# EAGLE design esquema (EAGLE 6.6.0)
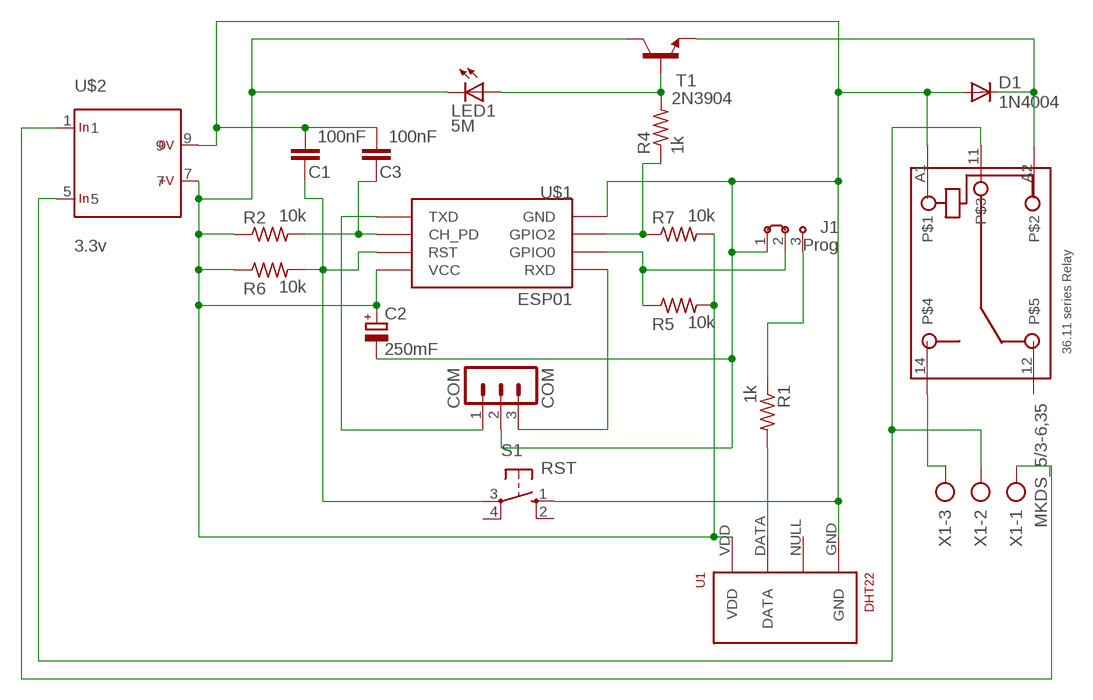
[diagram p0: schematic, sheet 1]

## Parts
C1  100nF  0.1UF-50V-20%(PTH)KIT-EZ  [CAP-PTH-SMALL-KIT]
C2  250mF  CPOL-EUE2-5  [E2-5]
C3  100nF  0.1UF-50V-20%(PTH)KIT-EZ  [CAP-PTH-SMALL-KIT]
COM  COM  MA03-1  [MA03-1]
D1  1N4004  [DO41-10]
J1  Prog  J2X2MM  [04C]
K1  36.11  [36.11]
LED1  5M  LED3MM  [LED3MM]
R1  1k  R-US_0204/5  [0204/5]
R2  10k  R-US_0204/5  [0204/5]
R4  1k  R-US_0204/5  [0204/5]
R5  10k  R-US_0204/5  [0204/5]
R6  10k  R-US_0204/5  [0204/5]
R7  10k  R-US_0204/5  [0204/5]
S1  RST  10-XX  [B3F-10XX]
T1  2N3904  [TO92]
U1  DHT22  RHT03_DHT-22_AM2302  [RHT03_DHT-22]
U$1  ESP01  [ESP01]
U$2  3.3v  SINGLE  [1]
X1  MKDS_5/3-6,35  [MKDS_5/3-635]

## Nets
GPI02: R4.1 R7.1 U$1.GPIO2
GPIO0: J1.2 R5.1 U$1.GPIO0
N$1: D1.C K1.A2 T1.3(E)
N$2: C3.1 R2.2 U$1.CH_PD
N$3: J1.3 R1.1
N$6: K1.11 U$2.5 X1.2
N$7: LED1.A R4.2 T1.2(B)
N$9: R1.2 U1.DATA
N$13: COM.1 U$1.TX(TXD)
N$14: COM.3 U$1.RX(RXD)
N$16: U$2.1 X1.1
N$17: K1.14 X1.3
RST: C1.1 R6.2 S1.3(P) U$1.RST
V0: C1.2 C2.- C3.2 COM.2 D1.A J1.1 K1.A1 S1.1(S) U1.GND U$1.GND U$2.9
V+: C2.+ LED1.K(C) R2.1 R5.2 R6.1 R7.2 T1.1(C) U1.VDD U$1.VCC U$2.7
Unconnected: K1.12 S1.2(S1) S1.4(P1) U1.NULL

## Library data of the parts
C1 C3 = SparkFun-Capacitors:0.1UF-50V-20%(PTH): CAP-08370; PROD_ID: CAP-08370
C2 = resistor:CPOL-EU: POLARIZED CAPACITOR, European symbol
COM = con-lstb:MA03-1: PIN HEADER; MF: MOLEX; MPN: 47053-1000; OC_FARNELL: 2313705; OC_NEWARK: unknown
D1 = diode:1N4004: DIODE general purpose rectifier, 1 A; MF: VISHAY; MPN: 1N4004-E3/54; OC_FARNELL: 1836082
J1 = jumper:J2: Jumper switch 2 x 2.5 mm
K1 = relay_finder_36_11:36.11: Printed circuit mount miniature 10 A relay one pole changeover contacts Conform RoHS
LED1 = led:LED: LED OSRAM: - CHIPLED LG R971, LG N971, LY N971, LG Q971, LY Q971, LO R971, LY R971 LH N974, LH R974 LS Q976, LO Q976, LY Q976 LO Q996 - Hyper CHIPLED LW Q18S LB Q993, LB Q99A, LB R99A - SideLED LS A670, LO A670, LY A670, LG A670, LP A670 LB A673, LV A673, LT A673, LW A673 LH A674 LY A675 LS A676, LA A676, LO A676, LY A676, LW A676 LS A679, LY A679, LG A679 - Hyper Micro SIDELED® LS Y876, LA Y876, LO Y876, LY Y876 LT Y87S - SmartLED LW L88C, LW L88S LB L89C, LB L89S, LG L890 LS L89K, LO L89K, LY L89K LS L896, LA L896, LO L896, LY L896 - TOPLED LS T670, LO T670, LY T670, LG T670, LP T670 LSG T670, LSP T670, LSY T670, LOP T670, LYG T670 LG T671, LOG T671, LSG T671 LB T673, LV T673, LT T673, LW T673 LH T674 LS T676, LA T676, LO T676, LY T676, LB T676, LH T676, LSB T676, LW T676 LB T67C, LV T67C, LT T67C, LS T67K, LO T67K, LY T67K, LW E67C LS E67B, LA E67B, LO E67B, LY E67B, LB E67C, LV E67C, LT E67C LW T67C LS T679, LY T679, LG T679 LS T770, LO T770, LY T770, LG T770, LP T770 LB T773, LV T773, LT T773, LW T773 LH T774 LS E675, LA E675, LY E675, LS T675 LS T776, LA T776, LO T776, LY T776, LB T776 LHGB T686 LT T68C, LB T68C - Hyper Mini TOPLED® LB M676 - Mini TOPLED Santana® LG M470 LS M47K, LO M47K, LY M47K Source: http://www.osram.convergy.de LUXEON: - LUMILED® LXK2-PW12-R00, LXK2-PW12-S00, LXK2-PW14-U00, LXK2-PW14-V00 LXK2-PM12-R00, LXK2-PM12-S00, LXK2-PM14-U00 LXK2-PE12-Q00, LXK2-PE12-R00, LXK2-PE12-S00, LXK2-PE14-T00, LXK2-PE14-U00 LXK2-PB12-K00, LXK2-PB12-L00, LXK2-PB12-M00, LXK2-PB14-N00, LXK2-PB14-P00, LXK2-PB14-Q00 LXK2-PR12-L00, LXK2-PR12-M00, LXK2-PR14-Q00, LXK2-PR14-R00 LXK2-PD12-Q00, LXK2-PD12-R00, LXK2-PD12-S00 LXK2-PH12-R00, LXK2-PH12-S00 LXK2-PL12-P00, LXK2-PL12-Q00, LXK2-PL12-R00 Source: www.luxeon.com KINGBRIGHT: KA-3528ASYC Source: www.kingbright.com; MF: VISHAY; MPN: HVR3700001504JA100; OC_FARNELL: 9477292
R1 = resistor:R-US_: RESISTOR, American symbol; MF: MULTICOMP; MPN: MCF 0.25W 1K; OC_FARNELL: 9339051
R2 R4-R7 = resistor:R-US_: RESISTOR, American symbol; MF: MULTICOMP; MPN: MCF 0.25W 10K; OC_FARNELL: 9339060
S1 = switch-omron:10-XX: OMRON SWITCH; MPN: B3F-1000; OC_FARNELL: 176432; OC_NEWARK: 36M3542
T1 = transistor:2N3904: NPN TRANSISTOR; MF: MULTICOMP; MPN: 2N3904; OC_FARNELL: 1574370
U1 = RHT03_DHT-22_AM2302:RHT03_DHT-22_AM2302: RHT03 / DHT-22 / AM2302 Packages and symbol for the RHT03 / DHT-22 relative humidity and temperature sensor. Note: The AM2302 is a wired version of the DHT-22 which typically requires less clearance and is thus provided as a separate package.; OC_FARNELL: unknown; PROD_ID: SEN-10167
U$1 = esp8266modules:ESP01: ESP8266 Wifi module 01; OC_FARNELL: unknown
U$2 = myrra:SINGLE: One Output Input voltage range: 85 to 265 V AC or 85 to 370 V DC Input frequency: 47 to 440 Hz Output voltage accuracy (full load ): ± 2% Line output voltage variation: ± 0.3% Load output voltage variation: ± 0.5% Temperature range: -25 - TA (°C) No load input power: < 200mW regulated: Reference Output Current Power Efficiency Ta Volts mA Watts % °C 47121 3.3 750 2.5 65 +70 47122 5 550 2.75 68 +70 47123 9 270 2.5 72 +70 47124 12 210 2.5 74 +70 47125 15 170 2.5 75 +70 47126 24 110 2.5 77 +70 47151 3.3 1350 4.2 65 +50 47152 5 900 4.5 68 +50 47153 9 550 5 72 +50 47154 12 420 5 75 +50 47155 15 320 5 76 +50 47156 24 220 5 79 +50 non regulated: Reference Output Current Power Efficiency Ta Volts mA Watts % °C 47114 12 200 2.4 74 +70 47133 9 360 3.2 73 +70 47134 12 270 3.2 75 +70 47136 24 130 3.2 80 +70 47163 9 560 5* 73 +50 47164 12 420 5* 75 +50 47166 24 210 5* 80 +50 * Nota: Power up to 5.4W is possible with input voltage > 97 V AC Source: http://www.myrra.com; MF: MYRRA; MPN: 47121; OC_FARNELL: 1825772
X1 = con-phoenix-mkds_5:MKDS_5/3-: MKDS 5/3-6,35 Source: PHOENIX CONTACT; MF: FARNELL; MPN: 1714968; OC_FARNELL: 3704695; OC_NEWARK: 71C4092

## Board
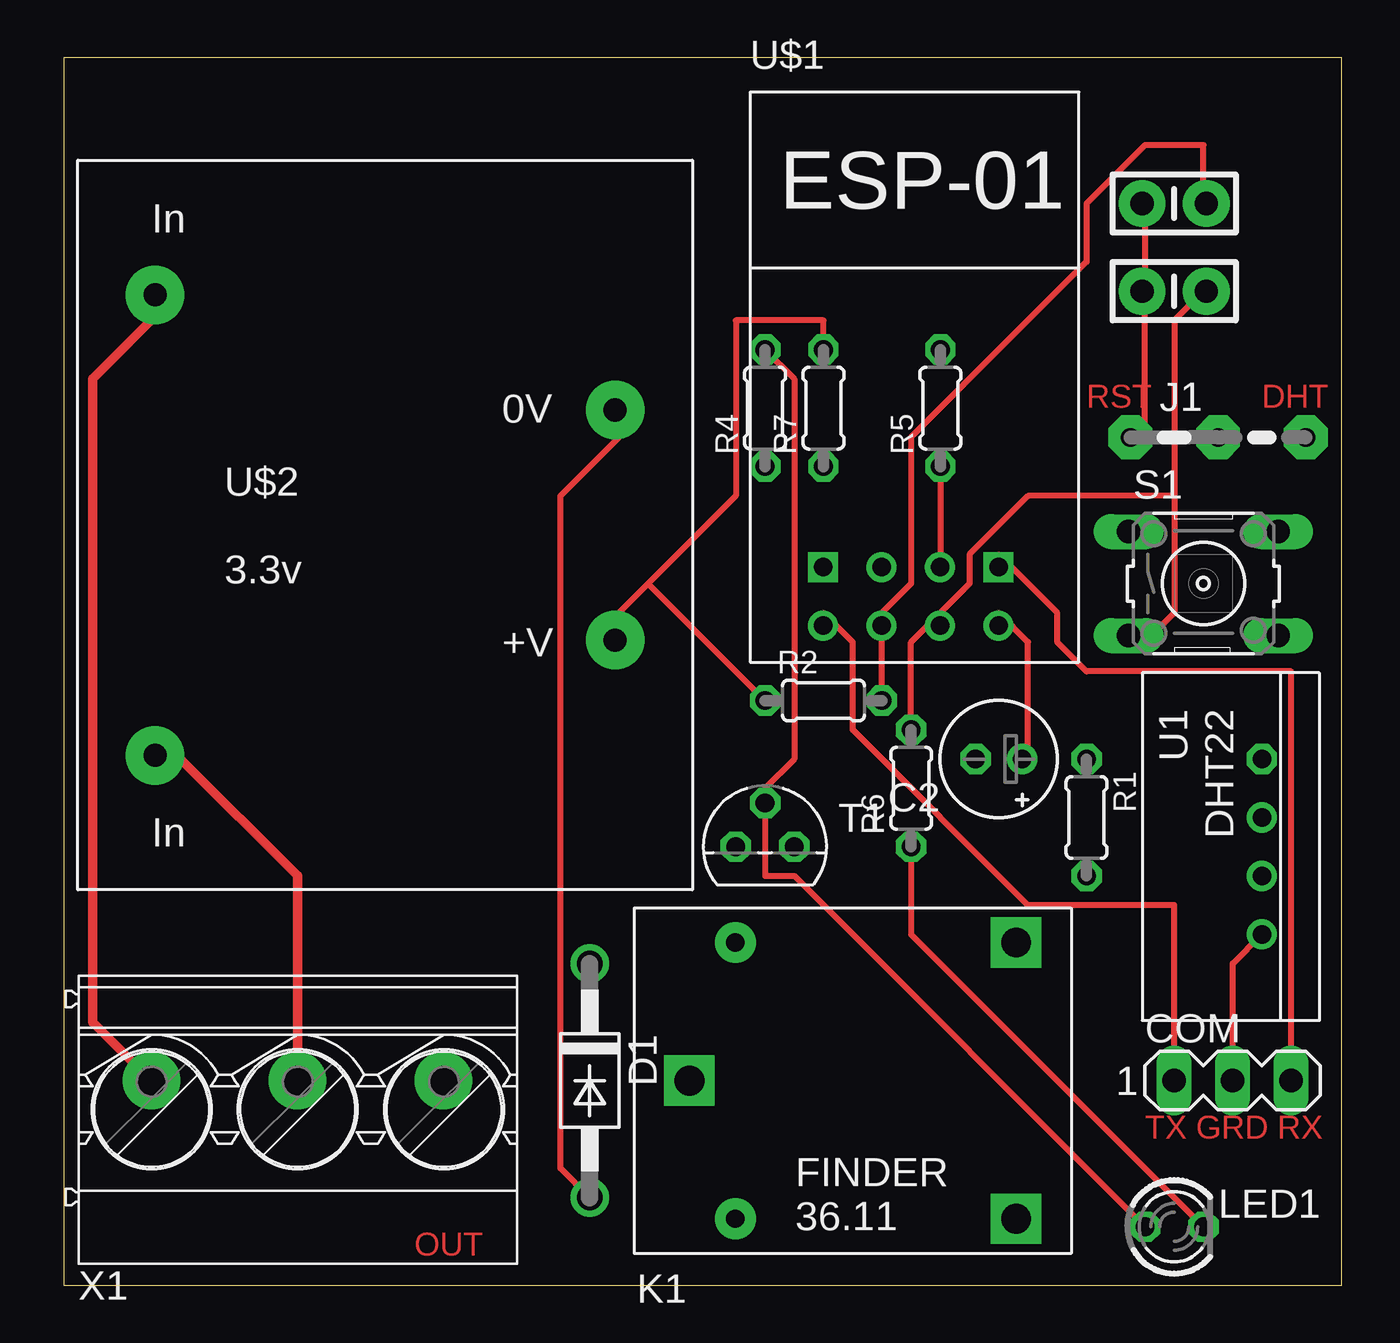
[diagram p1: board, top side]
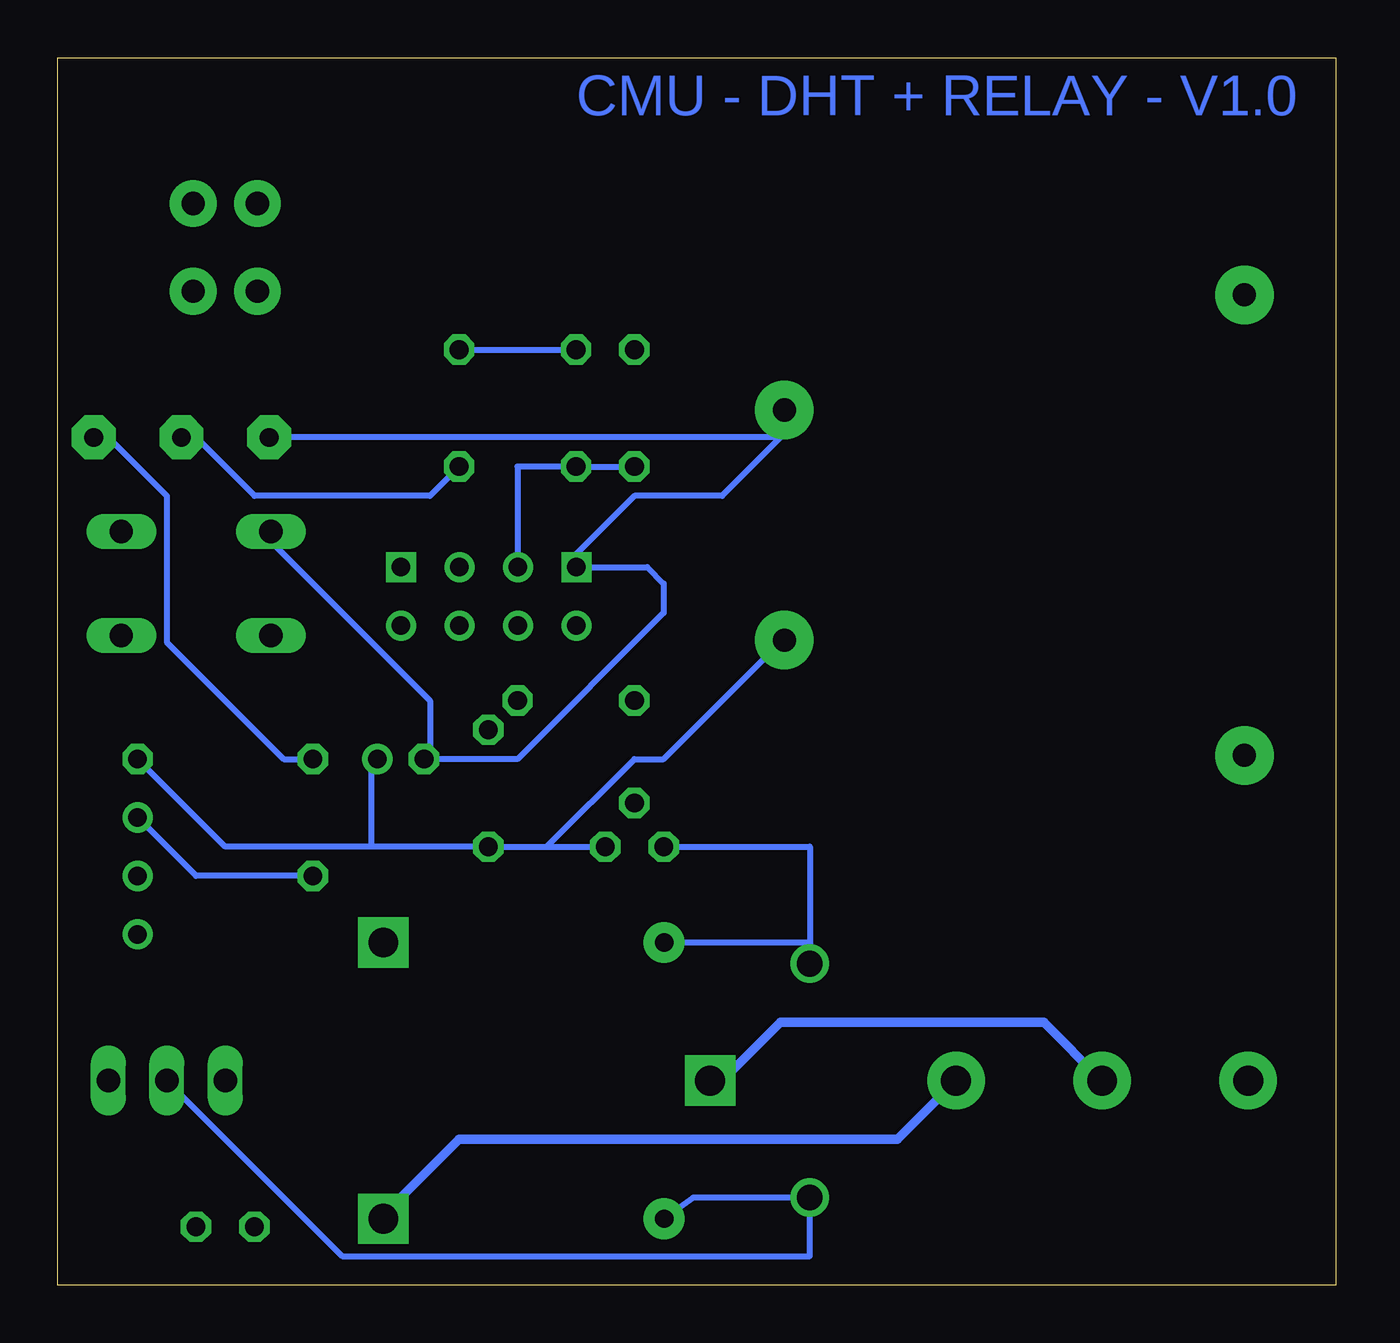
[diagram p2: board, bottom side, seen from below]

Size 55.55 x 53.33 mm. Coordinates in mm from the lower left corner, seen from the top.
Outline: 0,0 55.55,0 55.55,53.33 0,53.33 0,0
Copper layers (1*16): Top 0.035mm / dielectric 1.5mm / Bottom 0.035mm
Design rules "default": minimum track width 10mil, minimum drill 24mil, track to track 8mil, track to pad 8mil, pad to pad 8mil, via to via 8mil, smd to smd 8mil, copper to edge 40mil, drill to drill 8mil, minimum pad ring 10mil, minimum via ring 8mil, stop-mask expansion 4mil, vias tented up to drill 0mil, thermal gap 10mil

### Footprints (pad centres in the part's own frame; a part is rotated, then mirrored left to right if it is on the bottom)
CAP-PTH-SMALL-KIT = drill 1.016 pad 2.032: 1 -1.397,0; 2 1.397,0
E2-5 = drill 0.813 pad 1.27: + -1.016,0 | drill 0.813 pad 1.27 octagon: - 1.016,0
MA03-1 = drill 1.016 long: 1 -2.54,0; 2 0,0; 3 2.54,0
DO41-10 = drill 1.118: A 5.08,0; C -5.08,0
04C = drill 0.813 pad 1.905 octagon: 1 -1.905,0; 2 1.905,0; 3 5.715,0
36.11 = drill 1.3 pad 2.184 square: 11 -7.1,0; 12 7.1,6; 14 7.1,-6 | drill 0.8 pad 1.778: A1 -5.1,-6; A2 -5.1,6
LED3MM = drill 0.813 octagon: A -1.27,0; K 1.27,0
0204/5 = drill 0.813 octagon: 1 -2.54,0; 2 2.54,0
B3F-10XX = drill 1.016 long: 1 -3.251,2.261; 2 3.251,2.261; 3 -3.251,-2.261; 4 3.251,-2.261
TO92 = drill 0.813 octagon: 1 1.27,0; 2 0,1.905; 3 -1.27,0
RHT03_DHT-22 = drill 0.8: DATA -1.27,0; GND 3.81,0; NULL 1.27,0 | drill 0.8 octagon: VDD -3.81,0
ESP01 = drill 0.8: CH_PD -1.285,-8.178; GPIO0 1.255,-5.638; GPIO2 -1.285,-5.638; RST 1.255,-8.178; TX -3.825,-8.178; VCC 3.795,-8.178 | drill 0.8 square: GND -3.825,-5.638; RX 3.795,-5.638
1 = drill 1 pad 2.54: 1 -10,10; 5 -10,-10; 7 10,-5; 9 10,5
MKDS_5/3-635 = drill 1.3 pad 2.5: 1 -6.35,0; 2 0,0; 3 6.35,0

### Placement (x,y rotation side)
C1  48.26,43.18 180 top
C2  40.64,22.86 180 top
C3  48.26,46.99 180 top
COM  50.8,8.89 0 top
D1  22.86,8.89 270 top
J1  48.26,36.83 0 top
K1  34.29,8.89 0 top
LED1  48.26,2.54 0 top
R1  44.45,20.32 270 top
R2  33.02,25.4 0 top
R4  30.48,38.1 90 top
R5  38.1,38.1 90 top
R6  36.83,21.59 90 top
R7  33.02,38.1 90 top
S1  49.53,30.48 0 top
T1  30.48,19.05 0 top
U1  52.07,19.05 270 top
U$1  36.83,36.83 0 top
U$2  13.97,33.02 0 top
X1  10.16,8.89 0 top

### Tracks (layer width: path | path; a pad name or v marks a point on that pad's centre or on a via)
GPI02
  Bottom 0.254: U$1.GPIO2 35.56,31.75 35.56,35.56 R7.1 R4.1
GPIO0
  Top 0.254: R5.1 38.1,31.75 U$1.GPIO0
  Bottom 0.254: R5.1 39.37,34.29 46.99,34.29 49.53,36.83 J1.2
N$1
  Bottom 0.254: K1.A2 22.86,14.89 | 22.86,14.89 D1.C | T1.3 22.86,19.05 22.86,14.89
N$2
  Top 0.254: R2.2 35.56,29.21 | 35.56,29.21 36.83,30.48 36.83,36.83 44.45,44.45 44.45,46.99 46.99,49.53 49.53,49.53 49.53,46.99 C3.1 | 35.56,29.21 U$1.CH_PD
N$3
  Bottom 0.254: R1.1 45.72,22.86 50.8,27.94 50.8,34.29 53.34,36.83 J1.3
N$6
  Top 0.254: 5.08,22.86 U$2.5
  Top 0.406: 5.08,22.86 10.16,17.78 X1.2
  Bottom 0.406: X1.2 12.7,11.43 24.13,11.43 26.67,8.89 K1.11
N$7
  Top 0.254: R4.2 31.75,39.37 31.75,22.86 30.48,21.59 T1.2 30.48,17.78 31.75,17.78 LED1.A
N$9
  Bottom 0.254: U1.DATA 49.53,17.78 R1.2
N$13
  Top 0.254: COM.1 48.26,16.51 41.91,16.51 34.29,24.13 34.29,27.94 33.02,29.21 U$1.TX
N$14
  Top 0.254: COM.3 53.34,26.67 44.45,26.67 43.18,27.94 43.18,29.21 40.64,31.75 U$1.RX
N$16
  Top 0.254: 3.81,41.91 U$2.1
  Top 0.406: X1.1 1.27,11.43 1.27,39.37 3.81,41.91
N$17
  Bottom 0.406: X1.3 19.05,6.35 38.1,6.35 40.64,3.81 K1.14
RST
  Top 0.254: 38.1,29.21 36.83,27.94 R6.2 | 48.26,34.29 48.26,41.91 49.53,43.18 C1.1 | 48.26,34.29 48.26,29.21 46.99,27.94 S1.3 | 38.1,29.21 39.37,30.48 39.37,31.75 41.91,34.29 48.26,34.29 | 38.1,29.21 U$1.RST
V0
  Top 0.254: D1.A 21.59,5.08 21.59,34.29 24.13,36.83 U$2.9 | U1.GND 50.8,13.97 COM.2 | 46.99,43.18 46.99,46.99 C3.2 | 46.99,43.18 46.99,36.83 J1.1 | 46.99,43.18 C1.2
  Bottom 0.254: COM.2 43.18,1.27 22.86,1.27 D1.A 27.92,3.81 K1.A1 | 24.13,36.83 26.67,34.29 30.48,34.29 33.02,31.75 U$1.GND 29.92,31.19 29.21,30.48 29.21,29.21 35.56,22.86 C2.- 39.37,23.11 39.37,25.4 46.28,32.31 S1.1 | 24.13,36.83 J1.1 | 24.13,36.83 U$2.9
V+
  Top 0.254: 25.4,30.48 29.21,34.29 29.21,41.91 33.02,41.91 R7.2 | 25.4,30.48 24.13,29.21 U$2.7 | 25.4,30.48 R2.1 | U$1.VCC 40.64,29.21 41.91,27.94 41.91,22.86 C2.+ | LED1.K 36.83,15.24 R6.1
  Bottom 0.254: R5.2 R7.2 | 34.29,19.05 R6.1 41.91,19.05 | 34.29,19.05 T1.1 | 34.29,19.05 30.48,22.86 29.21,22.86 24.13,27.94 U$2.7 | U1.VDD 48.26,19.05 41.91,19.05 | 41.91,19.05 41.91,22.86 C2.+

### Text on the board
Top: RST | DHT | TX GRD RX | OUT
Bottom: CMU - DHT + RELAY - V1.0